# Altium project simple.PrjPCB
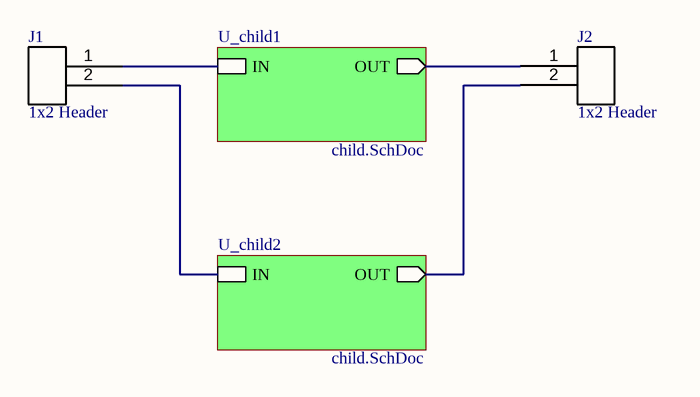
[diagram p0: parent.SchDoc]
2 sheets, 6 parts. Net scope: hierarchical (ports join the sheet entries above them; power ports are global).
Sheets:
  parent.SchDoc
    U_child1 = child.SchDoc
    U_child2 = child.SchDoc

## Sheet parent.SchDoc
size B

### Parts
J1  1x2 Header  [100_1_2]
J2  1x2 Header  [100_1_2]

### Sub-sheets
U_child1 = child.SchDoc: IN, OUT (out)
U_child2 = child.SchDoc: IN, OUT (out)

### Nets
IN: J1.1 ; sheet U_child1/IN
IN: J1.2 ; sheet U_child2/IN  [a separate net that carries the same name]
OUT: J2.1 ; sheet U_child1/OUT
OUT: J2.2 ; sheet U_child2/OUT  [a separate net that carries the same name]

### Library data of the parts
J1 J2 = 100_1_2: Generic 1x2 2.54mm pitch header; Manufacturer 1: HCTL; Manufacturer Part Number 1: PZ254-1-02-Z-8.5; manufacturer: Wavenumber; classification: connector/generic_2_54mm_header; id: 019a404e-43ec-7727-8aa5-54ca39edb9e9; kicad-footprint-path: footprints\100_1_2.kicad_mod; kicad-symbol-path: symbols\CON-1-2.kicad_sym; cad-reference: 100_1_2; kicad-footprint: 100_1_2; kicad-symbol: CON-1-2; mpn: 100_1_2; Value: 1x2 Header

## Sheet child.SchDoc
size B
Used 2 times, as channels U_child1, U_child2. Parts and nets are listed once, with the designators drawn on the sheet.
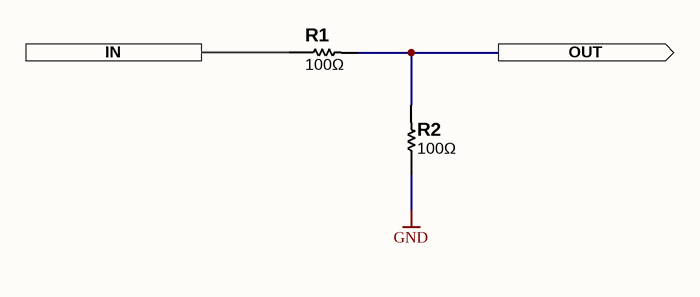
[diagram p1: child.SchDoc]

### Parts
R1  100Ω  [R0603_0.55MM_HD]
R2  100Ω  [R0603_0.55MM_HD]

### Ports
IN, OUT (out)

### Nets
GND: R2.1
IN: R1.1 ; port IN
OUT: R1.2 R2.2 ; port OUT

### Channels
U_child1: designators end in _1; ports IN=IN OUT=OUT
U_child2: designators end in _2; ports IN=IN OUT=OUT

### Library data of the parts
R1 R2 = ERJ-3EKF1000V: RES 100 OHM 1/10W 1% 0603 SMD; Manufacturer 1: Panasonic Electronic Components; Limiting Element Voltage: 75; Maximum Overload Voltage: 150; Maximum Working Voltage: 3.2V; Package Power: 0603  (0.1W); Power (Watts): 0.1W- 1/10W; Resistance (Ohms): 100; Substitution Notes: 100 , ±1% , 0603 , AEC-Q200; Temperature Coefficient: ±100ppm/°C; classification: resistor_jellybean/R0603; id: 019a404e-f116-7b31-fcc9-d0885ee13048; kicad-footprint-path: footprints\R0603_0.55MM_HD.kicad_mod; kicad-symbol-path: symbols\R_2P.kicad_sym; Composition: Thick Film; Features: -; Height: 0.55MM; Manufacturer Part Number 1: ERJ-3EKF1000V; Number of Terminations: 2; Package: 0603 (1608 Metric); Packaging: Cut Tape (CT); Ratings: AEC-Q200; Sort Value: 100.0; Sort Value Package: 603_100; Supplier Package: 603; Tolerance: ±1%; cad-reference: ERJ-3EKF1000V; jlc_pn: C193336; kicad-footprint: R0603_0.55MM_HD; kicad-symbol: R_2P; manufacturer: Panasonic Electronic Components; mpn: ERJ-3EKF1000V; Value: 100Ω

## Nets that join several sheets
GND: U_child1 (R2_1.1), U_child2 (R2_2.1)
IN: parent (J1.1), U_child1 (R1_1.1)
IN: parent (J1.2), U_child2 (R1_2.1)
OUT: parent (J2.1), U_child1 (R1_1.2 R2_1.2)
OUT: parent (J2.2), U_child2 (R1_2.2 R2_2.2)